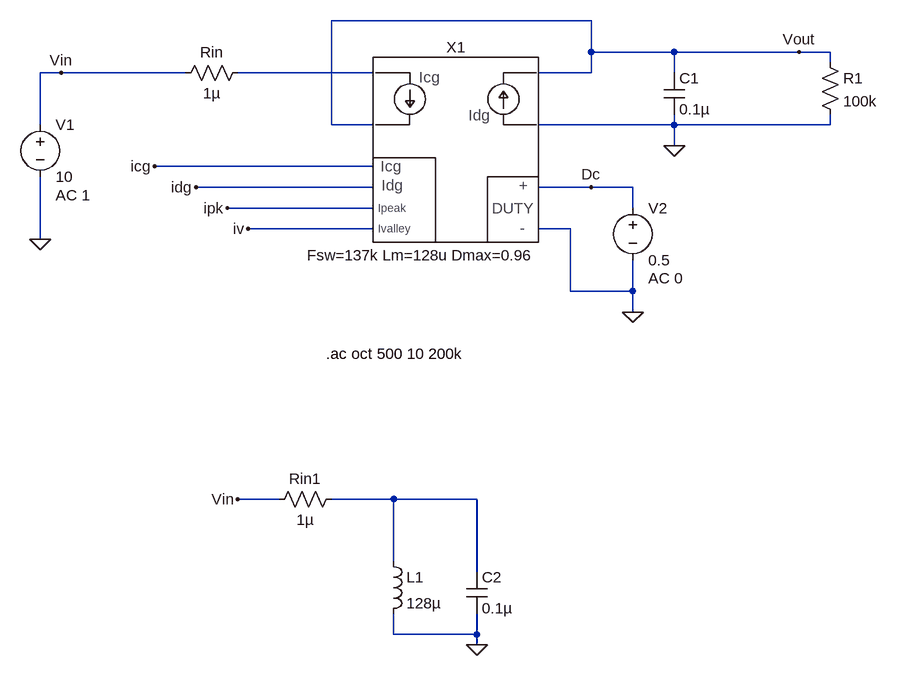
[diagram p0: schematic Test_Jig_input_impedance_AC.asc]
Test_Jig_input_impedance_AC.asc, the LTspice schematic file:
Version 4
SHEET 1 888 964
WIRE 400 -16 0 -16
WIRE 400 32 400 -16
WIRE 528 32 400 32
WIRE 720 32 528 32
WIRE 768 32 720 32
WIRE 768 48 768 32
WIRE -416 64 -448 64
WIRE -224 64 -416 64
WIRE 64 64 -144 64
WIRE 400 64 400 32
WIRE 400 64 320 64
WIRE 528 64 528 32
WIRE -448 144 -448 64
WIRE 0 144 0 -16
WIRE 64 144 0 144
WIRE 528 144 528 128
WIRE 528 144 320 144
WIRE 768 144 768 128
WIRE 768 144 528 144
WIRE 528 176 528 144
WIRE 64 208 -272 208
WIRE 64 240 -208 240
WIRE 400 240 320 240
WIRE 464 240 400 240
WIRE 64 272 -160 272
WIRE 464 272 464 240
WIRE 64 304 -128 304
WIRE 368 304 320 304
WIRE -448 320 -448 224
WIRE 368 400 368 304
WIRE 464 400 464 352
WIRE 464 400 368 400
WIRE 464 432 464 400
WIRE -80 720 -144 720
WIRE 96 720 0 720
WIRE 224 720 96 720
WIRE 96 816 96 720
WIRE 224 832 224 720
WIRE 96 928 96 896
WIRE 224 928 224 896
WIRE 224 928 96 928
WIRE 224 944 224 928
FLAG 528 176 0
FLAG -448 320 0
FLAG 464 432 0
FLAG 720 32 Vout
FLAG -416 64 Vin
FLAG 400 240 Dc
FLAG -272 208 icg
FLAG -208 240 idg
FLAG -160 272 ipk
FLAG -128 304 iv
FLAG 224 944 0
FLAG -144 720 Vin
DATAFLAG -208 208 ""
DATAFLAG -112 240 ""
DATAFLAG -112 272 ""
DATAFLAG -32 304 ""
DATAFLAG 592 32 ""
SYMBOL cap 512 64 R0
SYMATTR InstName C1
SYMATTR Value 0.1µ
SYMATTR SpiceLine Rser=10
SYMBOL res 752 32 R0
SYMATTR InstName R1
SYMATTR Value 100k
SYMBOL voltage -448 128 R0
WINDOW 123 24 124 Left 2
WINDOW 39 0 0 Left 0
SYMATTR Value2 AC 1
SYMATTR InstName V1
SYMATTR Value 10
SYMBOL voltage 464 256 R0
WINDOW 123 24 124 Left 2
WINDOW 39 0 0 Left 0
SYMATTR Value2 AC 0
SYMATTR InstName V2
SYMATTR Value 0.5
SYMBOL Duty_Control_IRM 192 144 R0
WINDOW 39 -229 201 Left 2
SYMATTR SpiceLine Fsw=137k Lm=128u Dmax=0.96
SYMATTR InstName X1
SYMBOL res -240 80 R270
WINDOW 0 32 56 VTop 2
WINDOW 3 0 56 VBottom 2
SYMATTR InstName Rin
SYMATTR Value 1µ
SYMBOL cap 208 832 R0
SYMATTR InstName C2
SYMATTR Value 0.1µ
SYMATTR SpiceLine Rser=10
SYMBOL ind 80 800 R0
SYMATTR InstName L1
SYMATTR Value 128µ
SYMBOL res -96 736 R270
WINDOW 0 32 56 VTop 2
WINDOW 3 0 56 VBottom 2
SYMATTR InstName Rin1
SYMATTR Value 1µ
TEXT -8 496 Left 2 !.ac oct 500 10 200k

The netlist it stands for:
* Test_Jig_input_impedance_AC.asc
C1 Vout 0 0.1µ Rser=10
R1 Vout 0 100k
V1 Vin 0 10 AC 1
V2 Dc 0 0.5 AC 0
XX1 Dc 0 N001 Vout Vout 0 icg idg ipk iv Duty_Control_IRM params: Fsw=137k Lm=128u Dmax=0.96  ; pins D+ D- Vcg+ Vcg- Vdg+ Vdg- Icharge Idischarge Ipeak Ivalley
Rin Vin N001 1µ
C2 N002 0 0.1µ Rser=10
L1 N002 0 128µ
Rin1 Vin N002 1µ
.ac oct 500 10 200k
.backanno
.end